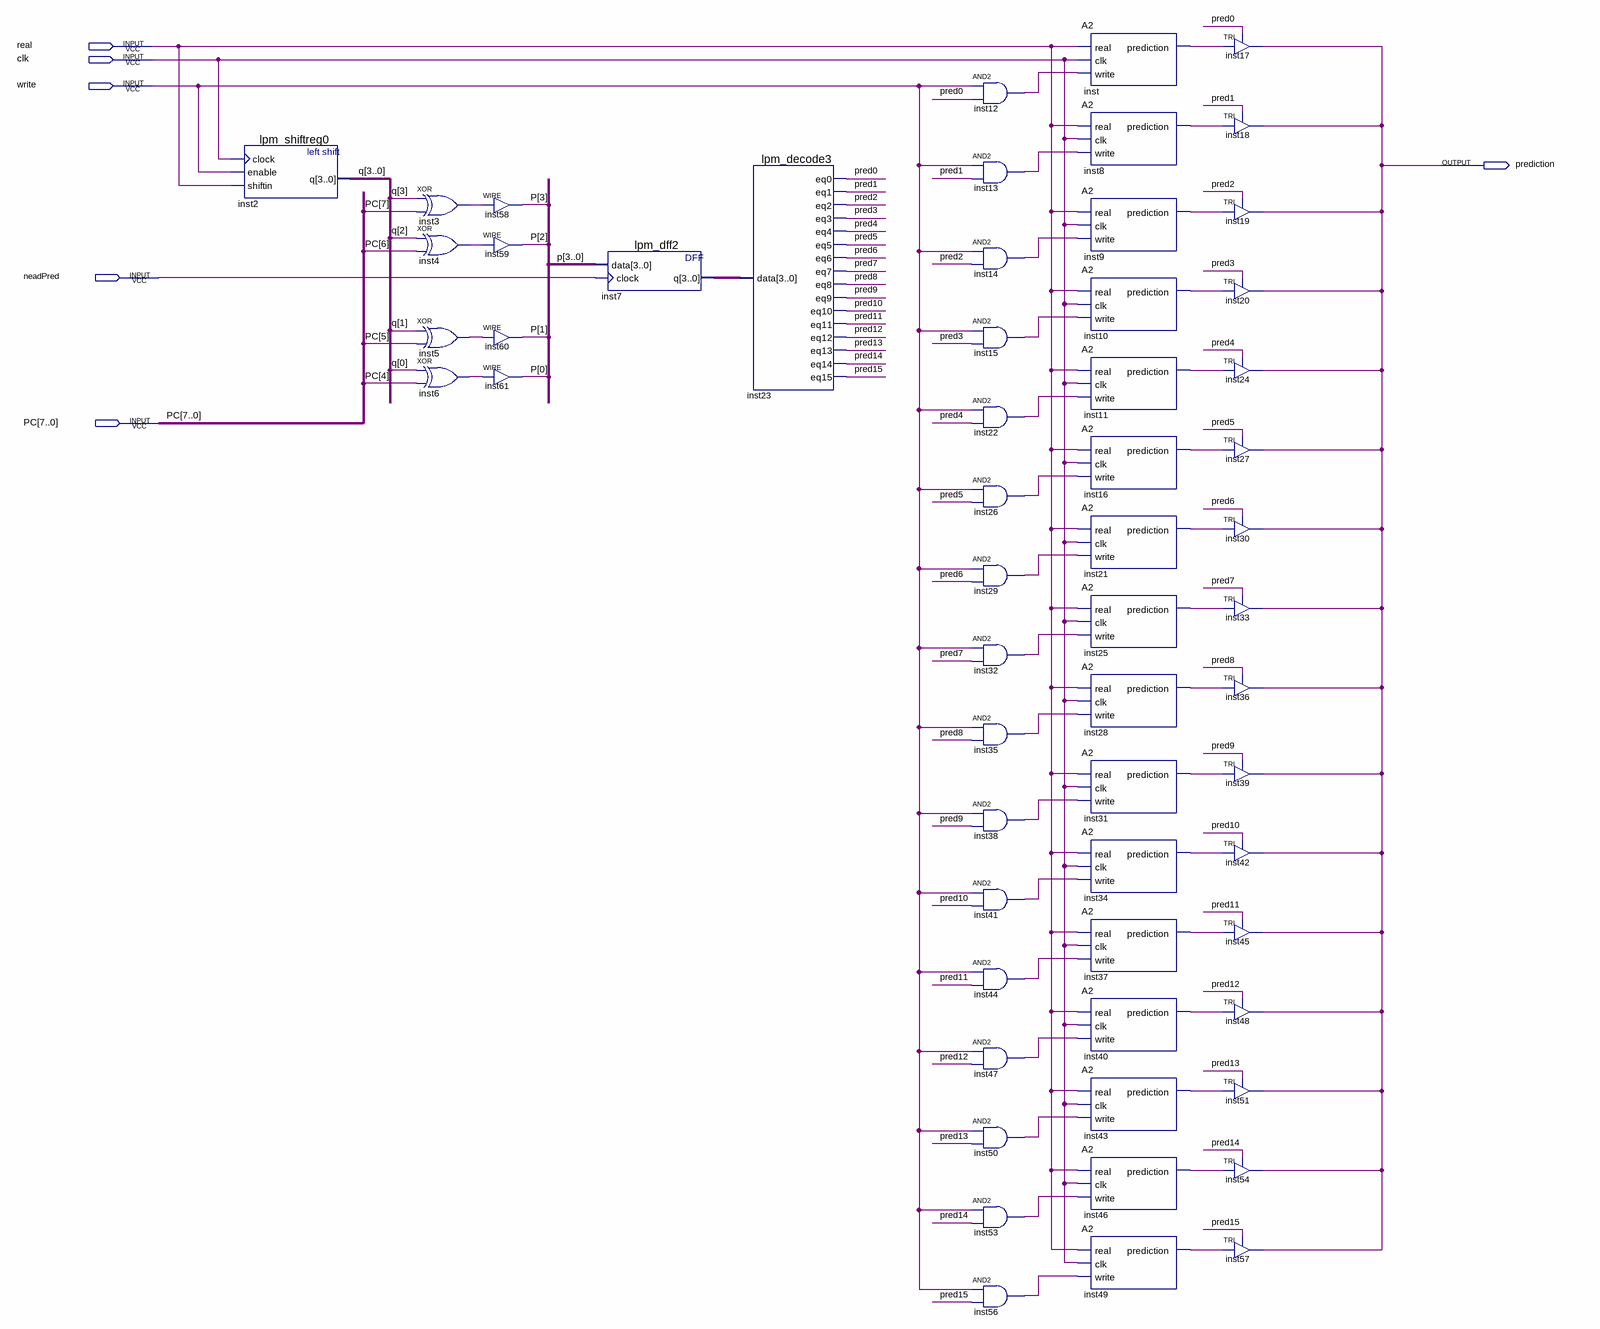
[diagram p0: schematic sheet]
// Quartus schematic predictions.bdf as structural Verilog: 59 symbols, 6 pins
module predictions (
  input  \real ,
  input  clk,
  input  write,
  input  neadPred,
  input  [7:0] PC,
  output prediction
);

  wire inst3_out, inst4_out, inst5_out, inst6_out, inst8_prediction, inst9_prediction, inst10_prediction,
       inst11_prediction, inst12_out, inst13_out, inst14_out, inst15_out, inst16_prediction,
       inst21_prediction, inst22_out, inst25_prediction, inst26_out, inst28_prediction, inst29_out,
       inst31_prediction, inst32_out, inst34_prediction, inst35_out, inst37_prediction, inst38_out,
       inst40_prediction, inst41_out, inst43_prediction, inst44_out, inst46_prediction, inst47_out,
       inst49_prediction, inst50_out, inst53_out, inst56_out, inst_prediction, pred0, pred1, pred2, pred3,
       pred4, pred5, pred6, pred7, pred8, pred9, pred10, pred11, pred12, pred13, pred14, pred15;
  wire [3:0] inst7_q, P, q;

  lpm_shiftreg0 inst2 (.clock(clk), .enable(write), .shiftin(\real ), .q(q));
  xor inst3 (inst3_out, q[3], PC[7]);
  xor inst4 (inst4_out, q[2], PC[6]);
  xor inst5 (inst5_out, q[1], PC[5]);
  xor inst6 (inst6_out, q[0], PC[4]);
  assign P[3] = inst3_out;  // WIRE inst58
  assign P[2] = inst4_out;  // WIRE inst59
  assign P[1] = inst5_out;  // WIRE inst60
  assign P[0] = inst6_out;  // WIRE inst61
  lpm_dff2 inst7 (.data(P), .clock(neadPred), .q(inst7_q));
  lpm_decode3 inst23 (
    .data(inst7_q), .eq0(pred0), .eq1(pred1), .eq2(pred2), .eq3(pred3), .eq4(pred4), .eq5(pred5),
    .eq6(pred6), .eq7(pred7), .eq8(pred8), .eq9(pred9), .eq10(pred10), .eq11(pred11), .eq12(pred12),
    .eq13(pred13), .eq14(pred14), .eq15(pred15));
  and inst12 (inst12_out, write, pred0);
  and inst13 (inst13_out, write, pred1);
  and inst14 (inst14_out, write, pred2);
  and inst15 (inst15_out, write, pred3);
  and inst22 (inst22_out, write, pred4);
  and inst26 (inst26_out, write, pred5);
  and inst29 (inst29_out, write, pred6);
  and inst32 (inst32_out, write, pred7);
  and inst35 (inst35_out, write, pred8);
  and inst38 (inst38_out, write, pred9);
  and inst41 (inst41_out, write, pred10);
  and inst44 (inst44_out, write, pred11);
  and inst47 (inst47_out, write, pred12);
  and inst50 (inst50_out, write, pred13);
  and inst53 (inst53_out, write, pred14);
  and inst56 (inst56_out, write, pred15);
  A2 inst (.\real (\real ), .clk(clk), .write(inst12_out), .prediction(inst_prediction));
  A2 inst8 (.\real (\real ), .clk(clk), .write(inst13_out), .prediction(inst8_prediction));
  A2 inst9 (.\real (\real ), .clk(clk), .write(inst14_out), .prediction(inst9_prediction));
  A2 inst10 (.\real (\real ), .clk(clk), .write(inst15_out), .prediction(inst10_prediction));
  A2 inst11 (.\real (\real ), .clk(clk), .write(inst22_out), .prediction(inst11_prediction));
  A2 inst16 (.\real (\real ), .clk(clk), .write(inst26_out), .prediction(inst16_prediction));
  A2 inst21 (.\real (\real ), .clk(clk), .write(inst29_out), .prediction(inst21_prediction));
  A2 inst25 (.\real (\real ), .clk(clk), .write(inst32_out), .prediction(inst25_prediction));
  A2 inst28 (.\real (\real ), .clk(clk), .write(inst35_out), .prediction(inst28_prediction));
  A2 inst31 (.\real (\real ), .clk(clk), .write(inst38_out), .prediction(inst31_prediction));
  A2 inst34 (.\real (\real ), .clk(clk), .write(inst41_out), .prediction(inst34_prediction));
  A2 inst37 (.\real (\real ), .clk(clk), .write(inst44_out), .prediction(inst37_prediction));
  A2 inst40 (.\real (\real ), .clk(clk), .write(inst47_out), .prediction(inst40_prediction));
  A2 inst43 (.\real (\real ), .clk(clk), .write(inst50_out), .prediction(inst43_prediction));
  A2 inst46 (.\real (\real ), .clk(clk), .write(inst53_out), .prediction(inst46_prediction));
  A2 inst49 (.\real (\real ), .clk(clk), .write(inst56_out), .prediction(inst49_prediction));
  TRI inst17 (.IN(inst_prediction), .OE(pred0), .OUT(prediction));
  TRI inst18 (.IN(inst8_prediction), .OE(pred1), .OUT(prediction));
  TRI inst19 (.IN(inst9_prediction), .OE(pred2), .OUT(prediction));
  TRI inst20 (.IN(inst10_prediction), .OE(pred3), .OUT(prediction));
  TRI inst24 (.IN(inst11_prediction), .OE(pred4), .OUT(prediction));
  TRI inst27 (.IN(inst16_prediction), .OE(pred5), .OUT(prediction));
  TRI inst30 (.IN(inst21_prediction), .OE(pred6), .OUT(prediction));
  TRI inst33 (.IN(inst25_prediction), .OE(pred7), .OUT(prediction));
  TRI inst36 (.IN(inst28_prediction), .OE(pred8), .OUT(prediction));
  TRI inst39 (.IN(inst31_prediction), .OE(pred9), .OUT(prediction));
  TRI inst42 (.IN(inst34_prediction), .OE(pred10), .OUT(prediction));
  TRI inst45 (.IN(inst37_prediction), .OE(pred11), .OUT(prediction));
  TRI inst48 (.IN(inst40_prediction), .OE(pred12), .OUT(prediction));
  TRI inst51 (.IN(inst43_prediction), .OE(pred13), .OUT(prediction));
  TRI inst54 (.IN(inst46_prediction), .OE(pred14), .OUT(prediction));
  TRI inst57 (.IN(inst49_prediction), .OE(pred15), .OUT(prediction));
endmodule
